# EAGLE design Maple6r (EAGLE 9.3.0)
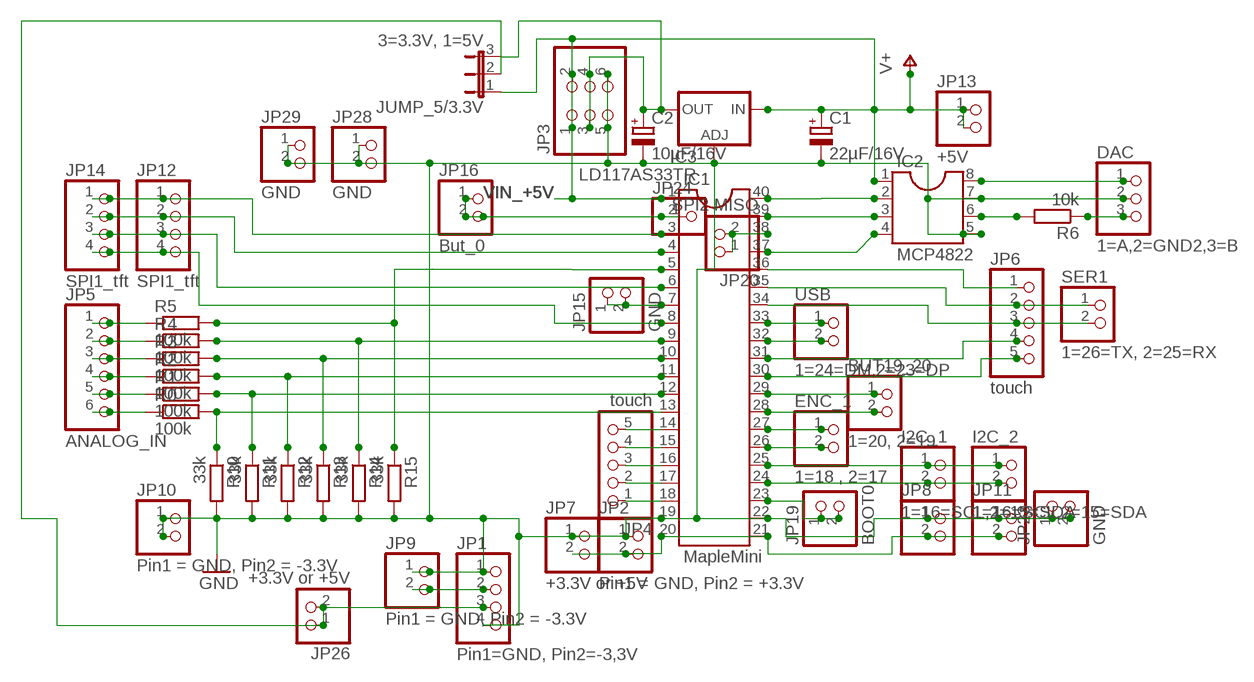
[diagram p0: schematic, sheet 1]

## Parts
BUT19_20  1=20, 2=19  PINHD-1X2  [1X02]
C1  22µF/16V  CPOL-EUE5-8.5  [E5-8,5]
C2  10µF/16V  CPOL-EUE5-8.5  [E5-8,5]
DAC  1=A,2=GND2,3=B  PINHD-1X3  [1X03]
ENC_1  1=18 , 2=17  PINHD-1X2  [1X02]
I2C_1  1=16=SCL,2=15=SDA  PINHD-1X2  [1X02]
I2C_2  1=16=SCL,2=15=SDA  PINHD-1X2  [1X02]
IC1  MapleMini  DIL40  [DIL40]
IC2  MCP4822  DIL8S  [SOCKET-08]
IC3  LD117AS33TR  [SOT223]
JP1  Pin1=GND, Pin2=-3,3V  PINHD-1X4  [1X04]
JP2  Pin1 = GND, Pin2 = +3.3V  PINHD-1X2  [1X02]
JP3  PINHD-2X3  [2X03]
JP4  touch  PINHD-1X5  [1X05]
JP5  ANALOG_IN  PINHD-1X6  [1X06]
JP6  touch  PINHD-1X5  [1X05]
JP7  +3.3V or +5V  PINHD-1X2  [1X02]
JP8  PINHD-1X2  [1X02]
JP9  Pin1 = GND, Pin2 = -3.3V  PINHD-1X2  [1X02]
JP10  Pin1 = GND, Pin2 = -3.3V  PINHD-1X2  [1X02]
JP11  PINHD-1X2  [1X02]
JP12  SPI1_tft  PINHD-1X4  [1X04]
JP13  +5V  PINHD-1X2  [1X02]
JP14  SPI1_tft  PINHD-1X4  [1X04]
JP15  GND  PINHD-1X2  [1X02]
JP16  But_0  PINHD-1X2  [1X02]
JP19  BOOT0  PINHD-1X2  [1X02]
JP20  SPI2 MISO  PINHD-1X2  [1X02]
JP23  GND  PINHD-1X2  [1X02]
JP24  PINHD-1X1  [1X01]
JP26  +3.3V or +5V  PINHD-1X2  [1X02]
JP28  GND  PINHD-1X2  [1X02]
JP29  GND  PINHD-1X2  [1X02]
JUMP_5/3.3V  3=3.3V, 1=5V  JP2E  [JP2]
R0  100k  R-EU_0207/7  [0207/7]
R1  100k  R-EU_0207/7  [0207/7]
R2  100k  R-EU_0207/7  [0207/7]
R3  100k  R-EU_0207/7  [0207/7]
R4  100k  R-EU_0207/7  [0207/7]
R5  100k  R-EU_0207/7  [0207/7]
R6  10k  R-EU_0207/7  [0207/7]
R10  33k  R-EU_0207/7  [0207/7]
R11  33k  R-EU_0207/7  [0207/7]
R12  33k  R-EU_0207/7  [0207/7]
R13  33k  R-EU_0207/7  [0207/7]
R14  33k  R-EU_0207/7  [0207/7]
R15  33k  R-EU_0207/7  [0207/7]
SER1  1=26=TX, 2=25=RX  PINHD-1X2  [1X02]
USB  1=24=DM,2=23=DP  PINHD-1X2  [1X02]

## Nets
1_PB10: IC1.3 JP12.1 JP14.1
2_PB2: IC1.4 JP12.2 JP14.2
3_PB0: IC1.5 R5.2 R15.1
4_PA7: IC1.6 JP12.3 JP14.3
6_PA5: IC1.8 JP12.4 JP14.4
7_PA4: IC1.10 R3.2 R13.1
8_PA3: IC1.11 R2.2 R12.1
10_PA1: IC1.12 R1.2 R11.1
11_PA0: IC1.13 R0.2 R10.1
GND: C1.- C2.- DAC.2 IC1.19 IC1.22 IC2.5 IC2.7 IC3.1(ADJ) JP1.1 JP1.4 JP2.1 JP3.5 JP3.6 JP7.1 JP8.1 JP9.1 JP10.1 JP10.2 JP11.1 JP23.1 JP23.2 JP28.1 JP28.2 JP29.1 JP29.2 R10.2 R11.2 R12.2 R13.2 R14.2 R15.2
N$1: IC1.9 R4.2 R14.1
N$2: JP5.1 R5.1
N$3: JP5.2 R4.1
N$4: JP5.3 R3.1
N$5: JP5.4 R2.1
N$6: JP5.5 R1.1
N$7: JP5.6 R0.1
N$8: IC1.30 JP6.5
N$9: IC1.7 JP15.1 JP15.2
N$10: IC1.32 USB.2
N$11: IC1.2 JP16.1 JP16.2 JP24.1
N$12: IC1.31 JP6.4
N$13: JP1.2 JP9.2
N$14: ENC_1.1 IC1.27
N$15: JP1.3 JP26.1 JP26.2 JUMP_5/3.3V.2
N$16: IC1.38 JP20.1 JP20.2
N$17: IC1.33 USB.1
N$18: IC1.36 JP6.1
N$19: IC1.35 JP6.2 SER1.1
N$20: IC2.6 R6.2
N$21: IC1.40 IC2.2
N$22: IC1.39 IC2.3
N$23: IC1.14 JP4.5
N$24: IC1.37 IC2.4
N$25: IC1.15 JP4.4
N$26: C2.+ IC3.4(OUT) JP3.3 JP3.4 JUMP_5/3.3V.3
N$27: IC1.34 JP6.3 SER1.2
N$28: IC1.16 JP4.3
N$29: IC1.17 JP4.2
N$30: IC1.18 JP4.1
N$32: BUT19_20.1 IC1.29
N$33: BUT19_20.2 IC1.28
N$35: ENC_1.2 IC1.26
N$36: I2C_1.1 I2C_2.1 IC1.25
N$37: I2C_1.2 I2C_2.2 IC1.24
N$38: IC1.23 JP19.1 JP19.2
N$39: IC1.20 IC1.21 JP2.2 JP7.2 JP8.2 JP11.2
N$44: DAC.3 R6.1
N$45: DAC.1 IC2.8
VIN_+5V: C1.+ IC1.1 IC2.1 IC3.3(IN) JP3.1 JP3.2 JP13.1 JP13.2 JUMP_5/3.3V.1 ; supply symbol labelled V+

## Library data of the parts
BUT19_20 ENC_1 I2C_1 I2C_2 JP2 JP7-JP11 JP13 JP15 JP16 JP19 JP20 JP23 JP26 JP28 JP29 SER1 USB = pinhead:PINHD-1X2: PIN HEADER
C1 C2 = rcl:CPOL-EU: POLARIZED CAPACITOR, European symbol; SPICEPREFIX: C
DAC = pinhead:PINHD-1X3: PIN HEADER
IC1 = ic-package:DIL40: Dual In Line
IC2 = ic-package:DIL8: Dual In Line / Socket
IC3 = v-reg:LD117A?*: Low drop fixed and adjustable positive voltage regulators 1 A Source: http://www.st.com/stonline/products/literature/ds/7194/ld1117axx.pdf
JP1 JP12 JP14 = pinhead:PINHD-1X4: PIN HEADER
JP3 = pinhead:PINHD-2X3: PIN HEADER
JP4 JP6 = pinhead:PINHD-1X5: PIN HEADER
JP5 = pinhead:PINHD-1X6: PIN HEADER
JP24 = pinhead:PINHD-1X1: PIN HEADER
JUMP_5/3.3V = jumper:JP2E: JUMPER
R0 R1-R6 R10-R15 = resistor:R-EU_: RESISTOR, European symbol

## Board
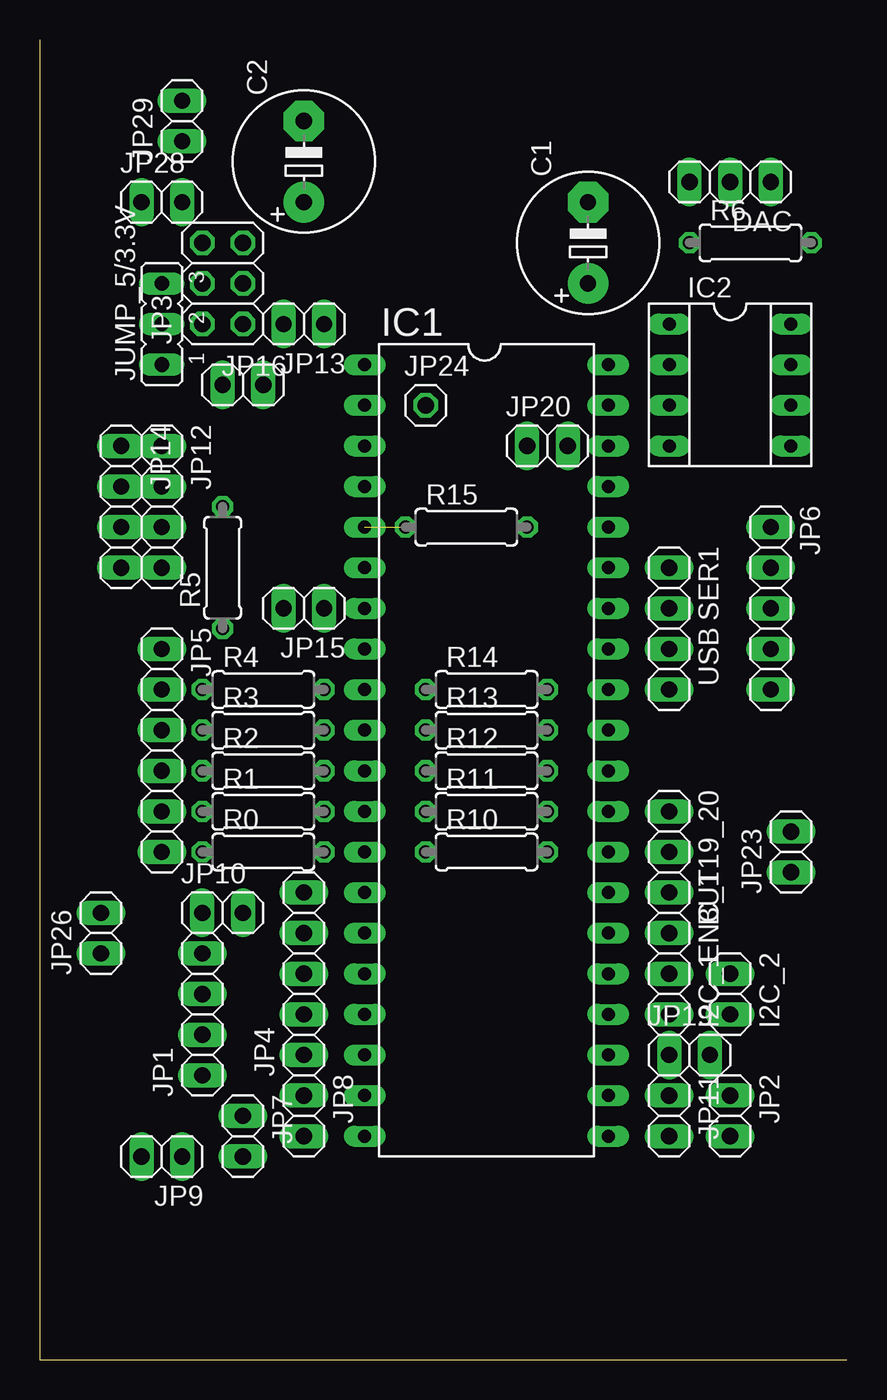
[diagram p1: board, top side]
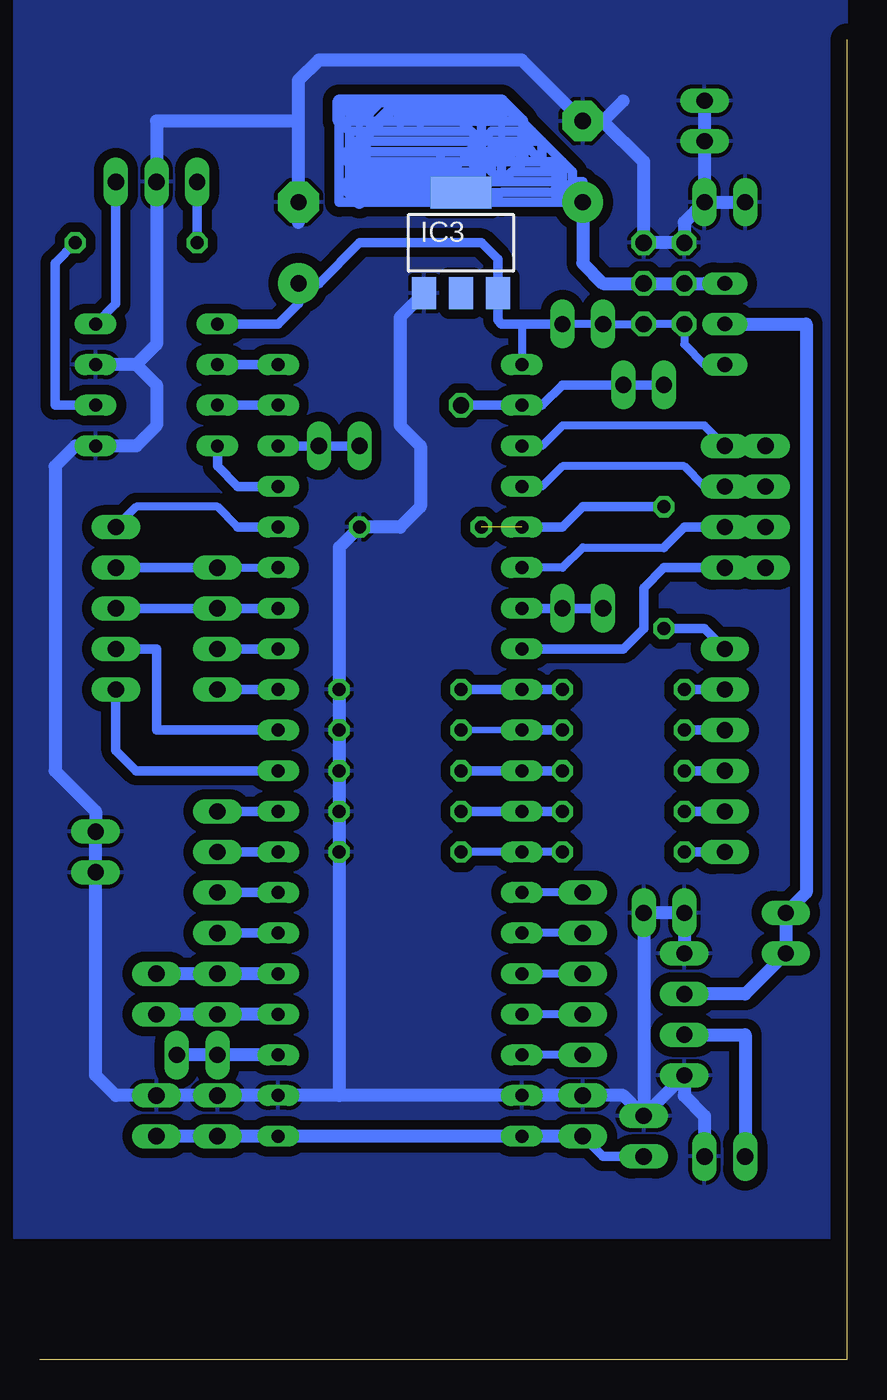
[diagram p2: board, bottom side, seen from below]

Size 50.47 x 82.54 mm. Coordinates in mm from the lower left corner, seen from the top.
Outline: 50.47,0 0,0 0,82.54
Copper layers (1*16): Top 0.035mm / dielectric 1.5mm / Bottom 0.035mm
Design rules "default": minimum track width 6mil, minimum drill 0.35mm, track to track 6mil, track to pad 6mil, pad to pad 6mil, via to via 6mil, smd to smd 6mil, copper to edge 40mil, drill to drill 6mil, minimum pad ring 10mil, minimum via ring 8mil, stop-mask expansion 4mil, vias tented up to drill 0mil, thermal gap 10mil

### Footprints (pad centres in the part's own frame; a part is rotated, then mirrored left to right if it is on the bottom)
1X02 = drill 1.016 long: 1 -1.27,0; 2 1.27,0
E5-8,5 = drill 1.016 pad 2.54: + -2.54,0 | drill 1.016 pad 2.54 octagon: - 2.54,0
1X03 = drill 1.016 long: 1 -2.54,0; 2 0,0; 3 2.54,0
DIL40 = drill 0.813 long: 1 -24.13,-7.62; 2 -21.59,-7.62; 3 -19.05,-7.62; 4 -16.51,-7.62; 5 -13.97,-7.62; 6 -11.43,-7.62; 7 -8.89,-7.62; 8 -6.35,-7.62; 9 -3.81,-7.62; 10 -1.27,-7.62; 11 1.27,-7.62; 12 3.81,-7.62; 13 6.35,-7.62; 14 8.89,-7.62; 15 11.43,-7.62; 16 13.97,-7.62; 17 16.51,-7.62; 18 19.05,-7.62; 19 21.59,-7.62; 20 24.13,-7.62; 21 24.13,7.62; 22 21.59,7.62; 23 19.05,7.62; 24 16.51,7.62; 25 13.97,7.62; 26 11.43,7.62; 27 8.89,7.62; 28 6.35,7.62; 29 3.81,7.62; 30 1.27,7.62; 31 -1.27,7.62; 32 -3.81,7.62; 33 -6.35,7.62; 34 -8.89,7.62; 35 -11.43,7.62; 36 -13.97,7.62; 37 -16.51,7.62; 38 -19.05,7.62; 39 -21.59,7.62; 40 -24.13,7.62
SOCKET-08 = drill 0.813 long: 1 -3.81,-3.81; 2 -1.27,-3.81; 3 1.27,-3.81; 4 3.81,-3.81; 5 3.81,3.81; 6 1.27,3.81; 7 -1.27,3.81; 8 -3.81,3.81
SOT223 = smd 1.5 x 2: 1 -2.3,-3.15; 2 0,-3.15; 3 2.3,-3.15 | smd 3.8 x 2: 4 0,3.15
1X04 = drill 1.016 long: 1 -3.81,0; 2 -1.27,0; 3 1.27,0; 4 3.81,0
2X03 = drill 1.016 octagon: 1 -2.54,-1.27; 2 -2.54,1.27; 3 0,-1.27; 4 0,1.27; 5 2.54,-1.27; 6 2.54,1.27
1X05 = drill 1.016 long: 1 -5.08,0; 2 -2.54,0; 3 0,0; 4 2.54,0; 5 5.08,0
1X06 = drill 1.016 long: 1 -6.35,0; 2 -3.81,0; 3 -1.27,0; 4 1.27,0; 5 3.81,0; 6 6.35,0
1X01 = drill 1.016 octagon: 1 0,0
JP2 = drill 0.914 long: 1 -2.54,0; 2 0,0; 3 2.54,0
0207/7 = drill 0.813 octagon: 1 -3.81,0; 2 3.81,0

### Placement (x,y rotation side)
BUT19_20  39.37,33.02 270 top
C1  34.29,69.85 90 top
C2  16.51,74.93 90 top
DAC  43.18,73.66 180 top
ENC_1  39.37,27.94 270 top
I2C_1  39.37,22.86 270 top
I2C_2  43.18,22.86 270 top
IC1  27.94,38.1 270 top
IC2  43.18,60.96 270 top
IC3  24.13,69.85 0 bottom
JP1  10.16,21.59 90 top
JP2  43.18,15.24 270 top
JP3  11.43,67.31 90 top
JP4  16.51,24.13 90 top
JP5  7.62,38.1 270 top
JP6  45.72,46.99 270 top
JP7  12.7,13.97 270 top
JP8  16.51,15.24 270 top
JP9  7.62,12.7 180 top
JP10  11.43,27.94 0 top
JP11  39.37,15.24 270 top
JP12  7.62,53.34 270 top
JP13  16.51,64.77 180 top
JP14  5.08,53.34 270 top
JP15  16.51,46.99 180 top
JP16  12.7,60.96 0 top
JP19  40.64,19.05 0 top
JP20  31.75,57.15 0 top
JP23  46.99,31.75 90 top
JP24  24.13,59.69 0 top
JP26  3.81,26.67 90 top
JP28  7.62,72.39 0 top
JP29  8.89,77.47 90 top
JUMP_5/3.3V  7.62,64.77 90 top
R0  13.97,31.75 0 top
R1  13.97,34.29 0 top
R2  13.97,36.83 0 top
R3  13.97,39.37 0 top
R4  13.97,41.91 0 top
R5  11.43,49.53 90 top
R6  44.45,69.85 0 top
R10  27.94,31.75 0 top
R11  27.94,34.29 0 top
R12  27.94,36.83 0 top
R13  27.94,39.37 0 top
R14  27.94,41.91 0 top
R15  26.67,52.07 0 top
SER1  39.37,48.26 270 top
USB  39.37,43.18 270 top

### Tracks (layer width: path | path; a pad name or v marks a point on that pad's centre or on a via)
1_PB10
  Bottom 0.508: JP12.1 8.89,58.42 17.78,58.42 19.05,57.15 IC1.3
  Bottom 0.61: JP14.1 JP12.1
2_PB2
  Bottom 0.508: IC1.4 19.05,54.61 17.78,55.88 10.16,55.88 8.89,54.61 JP12.2
  Bottom 0.61: JP14.2 JP12.2
3_PB0  (1 unrouted)
  Bottom 0.61: IC1.5 17.78,52.07 16.51,53.34 R5.2
4_PA7
  Bottom 0.508: IC1.6 17.78,49.53 16.51,50.8 11.43,50.8
  Bottom 0.61: JP14.3 JP12.3 10.16,52.07 11.43,50.8
6_PA5
  Bottom 0.61: JP14.4 JP12.4 11.43,49.53 12.7,48.26 12.7,45.72 13.97,44.45 IC1.8
7_PA4
  Bottom 0.406: IC1.10 R13.1
  Bottom 0.61: R3.2 IC1.10
8_PA3
  Bottom 0.61: R2.2 IC1.11 R12.1
10_PA1
  Bottom 0.61: R1.2 IC1.12 R11.1
11_PA0
  Bottom 0.508: R0.2 IC1.13 R10.1
GND
  Bottom 0.813: JP28.2 JP28.1 | JP28.2 10.16,71.12 JP3.6 JP3.5 12.7,74.93 15.24,77.47 | 15.24,77.47 C2.- 20.32,81.28 33.02,81.28 34.29,80.01 34.29,77.47 | 15.24,77.47 13.97,78.74 | 34.29,77.47 C1.- 34.29,71.12 | 34.29,77.47 43.18,77.47 DAC.2 43.18,63.5 44.45,62.23 | 44.45,62.23 IC2.7 | 44.45,62.23 43.18,60.96 43.18,58.42 44.45,57.15 IC2.5 48.26,57.15 49.53,55.88 49.53,36.83 46.99,34.29 JP23.2 JP23.1 46.99,17.78 45.72,16.51 JP2.1 JP11.1 IC1.22 31.75,16.51 | IC3.1 27.94,65.19 27.94,58.42 26.67,57.15 26.67,53.34 27.94,52.07 R15.2 31.75,50.8 R14.2 R13.2 R12.2 R11.2 R10.2 31.75,16.51 | JP1.4 JP10.1 JP10.2 JP7.1 | JP7.1 13.97,16.51 JP8.1 IC1.19 31.75,16.51 | JP7.1 JP1.1 10.16,16.51 8.89,15.24 JP9.1 | JP29.2 JP29.1 JP28.2
  pour Bottom (isolate 0.61): 0,85.09 52.07,85.09 52.07,7.62 0,7.62
N$1
  Bottom 0.61: R4.2 IC1.9 R14.1
N$2
  Bottom 0.61: JP5.1 8.89,45.72 R5.1
N$3
  Bottom 0.61: JP5.2 R4.1
N$4
  Bottom 0.61: JP5.3 R3.1
N$5
  Bottom 0.61: JP5.4 R2.1
N$6
  Bottom 0.61: JP5.5 R1.1
N$7
  Bottom 0.61: JP5.6 R0.1
N$8
  Bottom 0.61: IC1.30 44.45,36.83 45.72,38.1 JP6.5
N$9
  Bottom 0.61: JP15.2 JP15.1 IC1.7
N$10
  Bottom 0.61: IC1.32 USB.2
N$11
  Bottom 0.61: JP24.1 IC1.2 19.05,59.69 17.78,60.96 JP16.2 JP16.1
N$12
  Bottom 0.61: JP6.4 43.18,44.45 43.18,39.37 IC1.31
N$13
  Bottom 0.813: JP1.2 6.35,20.32 JP9.2
N$14
  Bottom 0.61: IC1.27 ENC_1.1
N$15
  Bottom 0.813: JUMP_5/3.3V.2 2.54,64.77 2.54,29.21 JP26.2 JP26.1 6.35,22.86 JP1.3
N$16
  Bottom 0.61: JP20.1 JP20.2 IC1.38
N$17
  Bottom 0.61: IC1.33 USB.1
N$18
  Bottom 0.508: 38.1,52.07 39.37,53.34 44.45,53.34 JP6.1
  Bottom 0.61: IC1.36 38.1,52.07
N$19
  Bottom 0.508: SER1.1 IC1.35
  Bottom 0.61: SER1.1 JP6.2
N$20
  Bottom 0.61: R6.2 49.53,68.58 49.53,59.69 IC2.6
N$21
  Bottom 0.61: IC1.40 IC2.2
N$22
  Bottom 0.61: IC1.39 IC2.3
N$23
  Bottom 0.508: JP4.5 IC1.14
N$24
  Bottom 0.61: IC2.4 39.37,55.88 38.1,54.61 IC1.37
N$25
  Bottom 0.508: JP4.4 IC1.15
N$26
  Bottom 0.508: 8.89,67.31 JUMP_5/3.3V.3
  Bottom 0.61: 22.86,76.2 22.86,77.47 | 22.86,77.47 24.13,77.47 | 31.75,72.98 31.75,77.47 | 24.13,72.39 30.48,72.39 | 30.48,72.39 31.75,72.39 31.75,72.98 | 24.13,72.39 22.86,73.66 22.86,74.27 | 24.13,77.47 23.5,76.84 | 31.75,77.47 30.48,77.47 27.94,77.47 26.67,77.47 24.13,77.47 | IC3.4 22.86,74.27 | 22.86,74.27 22.86,74.93 | 22.86,74.93 22.86,76.2 | 31.11,76.84 31.75,77.47 | 31.11,76.84 31.11,76.2 | 31.11,76.2 31.11,74.93 | 31.11,74.93 31.11,74.3 | 30.48,72.39 31.11,73.03 31.11,73.66 31.11,74.3 | 31.11,74.93 30.8,74.61 | 22.86,76.2 23.5,76.84 | 23.5,76.84 31.11,76.84 | 22.86,76.2 30.48,76.2 | 23.5,75.57 22.86,74.93 | 30.16,73.98 30.46,74.27 | 30.46,74.27 30.8,74.61 | 22.86,74.27 26.67,74.27 30.46,74.27 | 30.8,74.61 30.48,74.61 | 25.4,74.61 24.45,74.61 24.13,74.93 | 24.13,74.93 23.5,75.57 | 30.48,76.2 29.85,75.57 | 29.85,75.57 25.4,75.57 | 25.4,75.57 23.5,75.57 | 24.13,74.93 23.52,74.93 22.86,74.27 | 30.48,74.93 30.48,74.61 | 30.48,74.61 25.4,74.61 | 30.48,74.93 25.72,74.93 25.4,74.61 | 30.48,74.93 31.11,74.93 | 22.86,77.47 21.59,77.47 20.32,77.47 19.68,76.84 | 17.78,73.66 17.78,72.39 | IC3.4 22.2,73 21.59,72.39 | 21.59,72.39 24.13,72.39 | 17.78,74.93 19.05,76.2 | 19.05,76.2 19.68,76.84 | 19.68,76.84 20.32,76.84 | 20.32,76.84 22.22,76.84 22.86,76.2 | 22.86,76.2 21.59,76.2 20.32,76.2 | 19.05,74.93 20.32,76.2 | 22.86,74.93 22.22,75.57 22.22,74.93 | 19.05,74.93 20.32,74.93 | 21.59,74.93 20.32,74.93 | C2.+ 17.78,72.39 | 17.78,72.39 21.59,72.39 | 21.59,73.66 22.22,74.3 | 22.22,74.3 22.86,74.93 | 17.78,73.66 21.59,73.66 | 22.22,74.93 22.22,74.3 | IC3.4 21.59,73 21.57,73.03 18.42,73.03 | 17.78,73.66 18.42,73.03 | IC3.4 23.47,73.66 21.59,73.66 | 25.4,74.61 25.4,74.93 | 25.4,74.93 25.4,75.57
  Bottom 0.61: 20.32,74.93 20.96,74.3 | 20.96,74.3 21.59,73.66 | 20.96,74.3 18.42,74.3 | 21.59,73.66 21.59,74.93 | 20.32,76.2 20.32,76.84 | 24.13,74.93 25.4,74.93 | 21.59,74.93 22.22,74.93 | 30.48,76.2 31.11,76.2 | C2.+ 17.78,73.66 | 17.78,73.66 18.42,74.3 | 18.42,74.3 19.05,74.93 | 20.32,76.2 19.68,76.84 | 19.05,76.2 20.32,76.2 | 19.05,74.93 19.05,76.2 | 19.05,74.93 17.78,74.93 | 18.42,74.3 17.78,74.93 | C2.+ 17.14,73.03 17.14,73.66 | 17.78,74.93 17.14,74.3 17.14,73.66 | 17.78,74.93 17.78,73.66 | C2.+ 16.51,73.66 17.14,73.66 | 17.78,72.39 18.42,73.03 | 30.48,74.93 30.48,76.2 | 30.46,74.27 31.75,72.98 | 31.11,74.3 30.8,74.61 | 30.8,74.61 30.48,74.93 | 29.85,75.57 30.48,74.93
  Bottom 0.813: 26.36,73.97 25.4,73 IC3.4 28.55,73 | 26.36,73.97 26.67,74.27 | 22.22,75.57 21.59,76.2 21.59,74.93 20.32,76.2 20.32,74.93 | 23.5,75.57 22.86,76.2 | 26.36,73.97 30.15,73.97 30.16,73.98 30.48,73.66 | 30.48,73.66 31.11,73.66 | 26.36,73.97 26.67,73.66 29.21,73.66 | 28.55,73 29.21,73.66 | 29.21,73.66 30.48,73.66 | 30.48,73.66 31.11,73.03 | 30.48,73.66 30.48,72.39 | 28.55,73 29.82,73 30.48,73.66 | C2.+ 16.51,68.58 15.24,67.31 JP3.3 JP3.4 8.89,67.31 | 20.32,77.47 21.59,78.74 | 31.75,78.74 30.48,78.74 | 30.48,78.74 29.21,78.74 | 29.21,78.74 27.94,78.74 | 27.94,78.74 22.86,78.74 | 22.86,78.74 21.59,78.74 | 31.75,77.47 31.75,78.74 | 21.59,78.74 21.59,77.47 22.22,78.11 | 22.22,78.11 22.86,78.74 | 31.75,78.74 30.48,77.47 | 30.48,78.74 30.48,77.47 | 29.21,78.74 30.48,77.47 | 27.94,78.74 31.11,75.57 31.11,74.93 | 27.94,78.74 27.94,77.47 | 27.94,78.74 27.31,78.11 | 27.31,78.11 26.67,77.47 | 22.22,78.11 27.31,78.11
N$27
  Bottom 0.61: IC1.34 SER1.2 JP6.3
N$28
  Bottom 0.508: JP4.3 IC1.16
N$29
  Bottom 0.508: JP4.2 IC1.17
N$30
  Bottom 0.508: JP4.1 IC1.18
N$32
  Bottom 0.61: IC1.29 BUT19_20.1
N$33
  Bottom 0.61: IC1.28 BUT19_20.2
N$35
  Bottom 0.61: IC1.26 ENC_1.2
N$36
  Bottom 0.813: IC1.25 I2C_1.1 I2C_2.1
N$37
  Bottom 0.813: IC1.24 I2C_1.2 I2C_2.2
N$38
  Bottom 0.813: IC1.23 JP19.1 JP19.2
N$39
  Bottom 0.61: JP8.2 15.24,12.7 JP7.2
  Bottom 0.813: JP8.2 IC1.20 IC1.21 JP11.2 JP2.2
N$44
  Bottom 0.61: DAC.3 R6.1
N$45
  Bottom 0.61: DAC.1 45.72,66.04 IC2.8
VIN_+5V
  Bottom 0.508: JUMP_5/3.3V.1 8.89,62.23 10.16,63.5 JP3.2 JP3.1 JP13.2 JP13.1 20.32,64.77 IC1.1
  Bottom 0.61: IC2.1 35.56,64.77 34.29,66.04 C1.+ 33.02,67.31 30.48,69.85 22.86,69.85 21.83,68.82 IC3.3 21.83,65.01 21.59,64.77 JP13.1